# Altium schematic sheet [01] - MCU.SchDoc
size A4
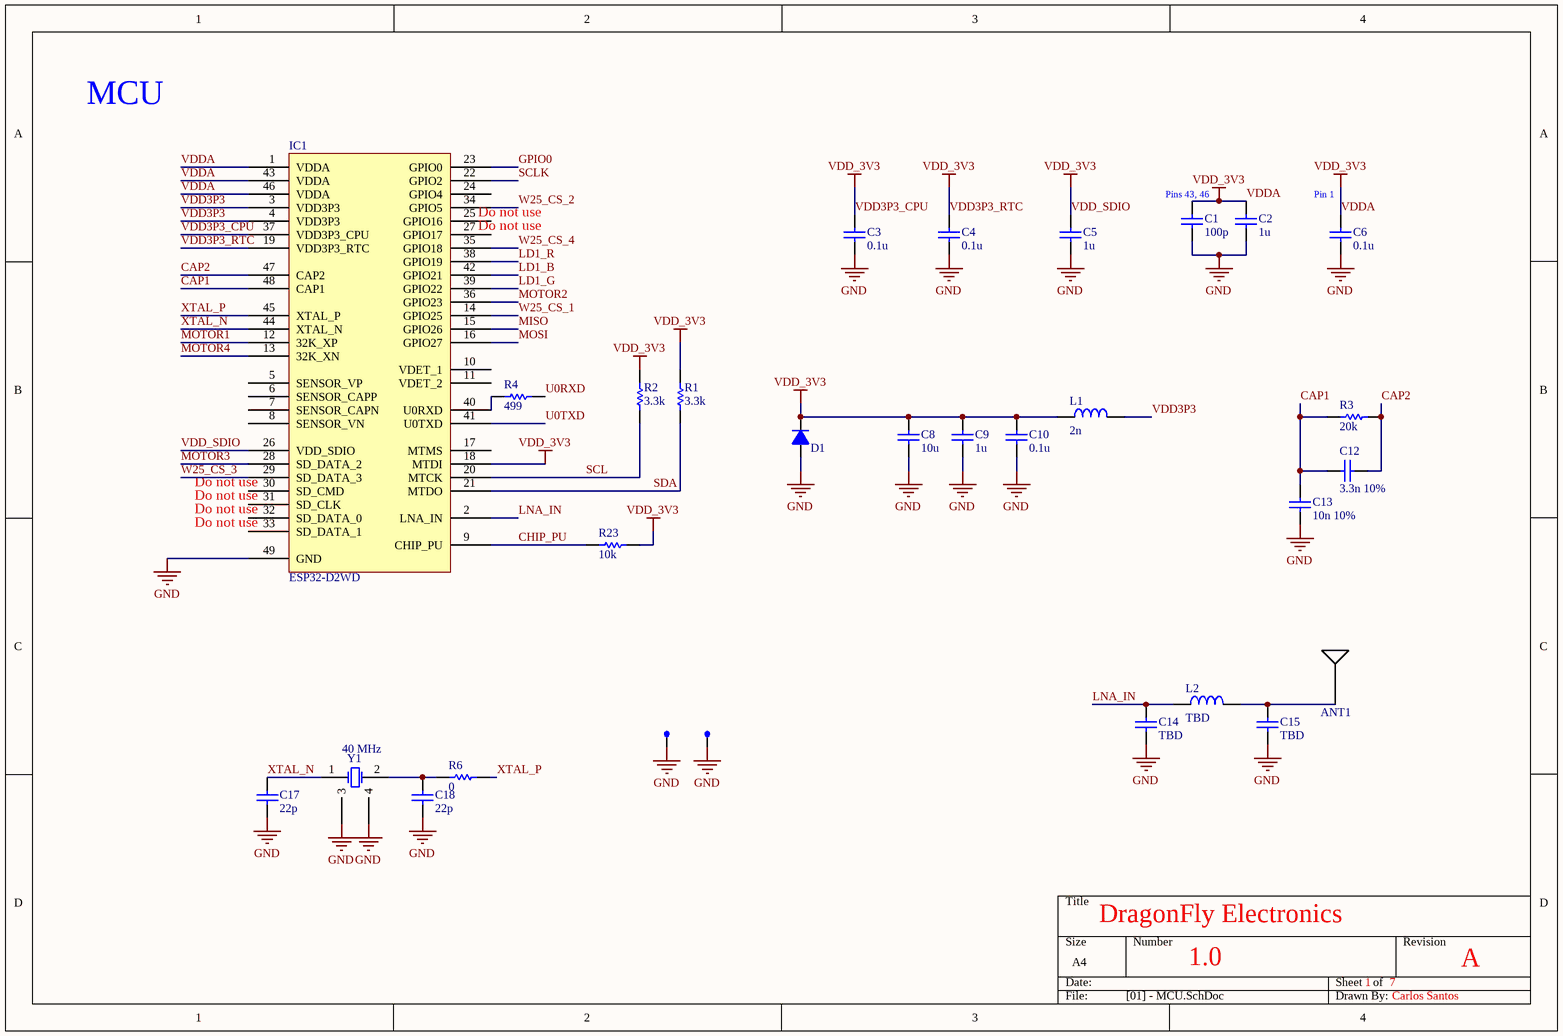
[diagram p0: [01] - MCU.SchDoc]

## Parts
ANT1  2.4 GHz Ant  [2450AT18A100E]  (value not drawn)
C1  value 100p  [0402 - Capacitor]  (hidden comment: Capacitor)
C2  value 1u  [0402 - Capacitor]  (hidden comment: Capacitor)
C3  value 0.1u  [0402 - Capacitor]  (hidden comment: Capacitor)
C4  value 0.1u  [0402 - Capacitor]  (hidden comment: Capacitor)
C5  value 1u  [0402 - Capacitor]  (hidden comment: Capacitor)
C6  value 0.1u  [0402 - Capacitor]  (hidden comment: Capacitor)
C8  value 10u  [0603 - Capacitor]  (hidden comment: Capacitor)
C9  value 1u  [0402 - Capacitor]  (hidden comment: Capacitor)
C10  value 0.1u  [0402 - Capacitor]  (hidden comment: Capacitor)
C12  value 3.3n 10%  [0402 - Capacitor]  (hidden comment: Capacitor)
C13  value 10n 10%  [0402 - Capacitor]  (hidden comment: Capacitor)
C14  value TBD  [0402 - Capacitor]  (hidden comment: Capacitor)
C15  value TBD  [0402 - Capacitor]  (hidden comment: Capacitor)
C17  value 22p  [0402 - Capacitor]  (hidden comment: Capacitor)
C18  value 22p  [0402 - Capacitor]  (hidden comment: Capacitor)
D1  Diode  [SOD 923]  (value not drawn)
IC1  ESP32-D2WD  [ESP32 QFN35P500X500X90_HS-49N]
L1  value 2n  [0402 - inductor]  (hidden comment: Inductor)
L2  value TBD  [0402 - inductor]  (hidden comment: Inductor)
R1  value 3.3k  [0402 - Resistor]  (hidden comment: Resistor)
R2  value 3.3k  [0402 - Resistor]  (hidden comment: Resistor)
R3  value 20k  [0402 - Resistor]  (hidden comment: Resistor)
R4  value 499  [0402 - Resistor]  (hidden comment: Resistor)
R6  value 0  [0402 - Resistor]  (hidden comment: Resistor)
R23  value 10k  [0402 - Resistor]  (hidden comment: Resistor)
SP1  Signal Point  [Signal_point_1mm]  (value not drawn)
SP2  Signal Point  [Signal_point_1mm]  (value not drawn)
Y1  value 40 MHz  [XTAL 1.6X1.2MM 4-SMD]  (hidden comment: XTAL_4)

## Nets
GND: C1.1 C2.1 C3.1 C4.1 C5.1 C6.1 C8.1 C9.1 C10.1 C13.1 C14.1 C15.1 C17.1 C18.1 D1.1(A) IC1.49(GND) SP1.0(VIN) SP2.0(VIN) Y1.3 Y1.4
VDD3P3_CPU: C1.2 C2.2 C3.2 C4.2 C5.2 C6.2 C8.2 C9.2 C10.2 D1.2(K) IC1.1(VDDA) IC1.18(MTDI) IC1.19(VDD3P3_RTC) IC1.26(VDD_SDIO) IC1.37(VDD3P3_CPU) IC1.43(VDDA) IC1.46(VDDA) L1.1 R1.2 R2.2 R23.1  [also labelled VDD3P3_RTC, VDD_3V3, VDD_SDIO, VDDA]
CAP1: C12.2 C13.2 IC1.48(CAP1) R3.2
CAP2: C12.1 IC1.47(CAP2) R3.1
CHIP_PU: IC1.9(CHIP_PU) R23.2
GPIO0: IC1.23(GPIO0)
LD1_B: IC1.42(GPIO21)
LD1_G: IC1.39(GPIO22)
LD1_R: IC1.38(GPIO19)
LNA_IN: C14.2 IC1.2(LNA_IN) L2.1
MISO: IC1.15(GPIO26)
MOSI: IC1.16(GPIO27)
MOTOR1: IC1.12(32K_XP)
MOTOR2: IC1.36(GPIO23)
MOTOR3: IC1.28(SD_DATA_2)
MOTOR4: IC1.13(32K_XN)
SCL: IC1.20(MTCK) R2.1
SCLK: IC1.22(GPIO2)
SDA: IC1.21(MTDO) R1.1
U0RXD: R4.1
U0TXD: IC1.41(U0TXD)
VDD3P3: IC1.3(VDD3P3) IC1.4(VDD3P3) L1.2
W25_CS_1: IC1.14(GPIO25)
W25_CS_2: IC1.34(GPIO5)
W25_CS_3: IC1.29(SD_DATA_3)
W25_CS_4: IC1.35(GPIO18)
XTAL_N: C17.2 IC1.44(XTAL_N) Y1.1(OSC1)
XTAL_P: IC1.45(XTAL_P) R6.1
NetANT1_1: ANT1.1 C15.2 L2.2
NetC18_2: C18.2 R6.2 Y1.2(OSC2)
NetIC1_40: IC1.40(U0RXD) R4.2

Not connected (* = marked no-connect by the designer): IC1 5(SENSOR_VP) 6(SENSOR_CAPP) 7(SENSOR_CAPN) 8(SENSOR_VN) 10(VDET_1) 11(VDET_2) 17(MTMS) 24(GPIO4) 25(GPIO16) 27(GPIO17) 30(SD_CMD) 31(SD_CLK) 32(SD_DATA_0) 33(SD_DATA_1)

## Notes on the sheet
- MCU
- (near IC1) Do not use
- (near C1) Pins 43, 46
- (near C6) Pin 1
- DragonFly Electronics
- 1.0
- 1
- 7
- A
- Carlos Santos

## Library data of the parts
ANT1 = 2.4 GHz Ant: 2.4GHz Chip RF Antenna 2.4GHz
SP1 SP2 = Signal Point: Value: DNP
D1 = Diode: DigiKey Part #: ESD9X5.0ST5GOSCT-ND
IC1 = ESP32-D2WD: DigiKey Part #: 1904-1005-1-ND
Y1 = XTAL_4: DigiKey Part #: 535-13987-1-ND